# Altium schematic sheet LCD.SchDoc
size A
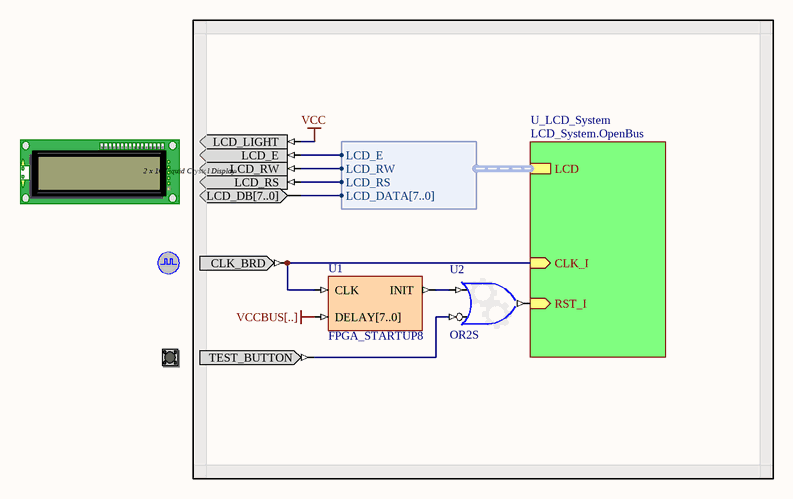
[diagram p0: LCD.SchDoc]

## Parts
(Parts that share a designator on the sheet are numbered #1, #2 ... from top to bottom, then left to right.)
?#1  LCD  (value not drawn)
?#2  CLOCK_BOARD  (value not drawn)
?#3  TEST_BUTTON  (value not drawn)
U1  FPGA_STARTUP8
U2  OR2S

## Sub-sheets
U_LCD_System = LCD_System.OpenBus: LCD (harness WB_LCDCTRL), RST_I (in), CLK_I (in)

## Harnesses
WB_LCDCTRL: LCD_E, LCD_RW, LCD_RS, LCD_DATA[7..0]

## Nets
VCC: ?#1.LCD_LIGHT
VCCBUS[..]: U1.DELAY[7..0]
Net?#1_LCD_DB[7..0]: ?#1.LCD_DB[7..0] ; sheet U_LCD_System/LCD.LCD_DATA[7..0]
Net?#1_LCD_E: ?#1.LCD_E ; sheet U_LCD_System/LCD.LCD_E
Net?#1_LCD_RS: ?#1.LCD_RS ; sheet U_LCD_System/LCD.LCD_RS
Net?#1_LCD_RW: ?#1.LCD_RW ; sheet U_LCD_System/LCD.LCD_RW
Net?#2_CLK_BRD: ?#2.CLK_BRD U1.CLK ; sheet U_LCD_System/CLK_I
Net?#3_TEST_BUTTON: ?#3.TEST_BUTTON U2.I1
NetU1_INIT: U1.INIT U2.I0
NetU2_O: U2.O ; sheet U_LCD_System/RST_I

## Notes on the sheet
- Title
- Size:
- Date:
- A
- Number:
- Time:
- Revision:
- Sheet
- of
- File:
- (in symbol LCD) 2 x 16 Liquid Crystal Display

## Library data of the parts
?#1 = LCD: Liquid Crystal Display; PortComponent: True; Published: 19-Nov-2003; Publisher: Altium Limited; HelpURL: TR0102 NanoBoard Technical Reference Manual - NB1.pdf#page=39
?#2 = CLOCK_BOARD: Global System Clock Supply; PortComponent: True; Published: 19-Nov-2003; Publisher: Altium Limited; HelpURL: TR0143 Technical Reference Manual for Altium's Desktop NanoBoard NB2DSK01.pdf#page=41; UseInDSF: True
?#3 = TEST_BUTTON: Test / Reset Button; PortComponent: True; Published: 19-Nov-2003; Publisher: Altium Limited; HelpURL: TR0143 Technical Reference Manual for Altium's Desktop NanoBoard NB2DSK01.pdf#page=53
U1 = FPGA_STARTUP8: FPGA Startup With 8 Bit Delay; Published: 9-Dec-2004; Publisher: Altium Limited; HelpURL: CR0119 FPGA_STARTUPx Powerup Delay Unit.pdf; LastRevisionNo: 1.00.00; ComponentLink1Description: Core &Resource Usage; ComponentLink1URL: CR0139 FPGA Peripheral Resource Usage.pdf#page=11
U2 = GATE: Configurable Generic Gate; ConfiguratorName: GENERIC_GATE; ConfigurationParameters: {}Version[1.0]{}GateKind[OR]{}BusInput[False]{}GateInputType[Bit]{}GateOutputOption[Normal]{}BusWidth[8]{}RegisterOutputs[False]{}NegativeClockEdge[False]{}InputCount[2]{}InputInvert0[False]{}InputInvert1[True]{}; LastRevisionNo: 1.00.00; Published: 3-Sep-2008; Publisher: Altium Limited